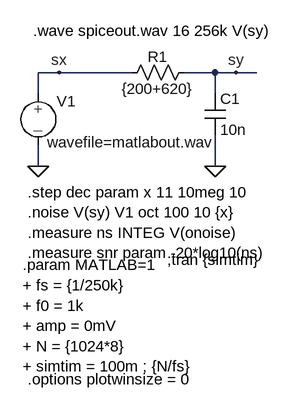
[diagram p0: schematic wavRead_matlab.asc]
wavRead_matlab.asc, the LTspice schematic file:
Version 4
SHEET 1 1008 720
WIRE 176 112 144 112
WIRE 288 112 176 112
WIRE 416 112 368 112
WIRE 448 112 416 112
WIRE 480 112 448 112
WIRE 144 144 144 112
WIRE 416 144 416 112
WIRE 144 256 144 224
WIRE 416 256 416 208
FLAG 144 256 0
FLAG 176 112 sx
FLAG 416 256 0
FLAG 448 112 sy
SYMBOL MDB_sym\\source-V 144 128 R0
WINDOW 3 14 91 Left 2
WINDOW 123 0 0 Left 2
WINDOW 39 0 0 Left 2
SYMATTR InstName V1
SYMATTR Value wavefile=matlabout.wav
SYMBOL res 272 128 R270
WINDOW 0 25 56 VTop 2
WINDOW 3 7 56 VBottom 2
SYMATTR InstName R1
SYMATTR Value {200+620}
SYMBOL cap 400 144 R0
SYMATTR InstName C1
SYMATTR Value 10n
TEXT 342 400 Left 2 !;tran {simtim}
TEXT 120 408 Left 2 !.param MATLAB=1\n+ fs = {1/250k}\n+ f0 = 1k\n+ amp = 0mV\n+ N = {1024*8}\n+ simtim = 100m ; {N/fs}
TEXT 136 48 Left 2 !.wave spiceout.wav 16 256k V(sy)
TEXT 128 584 Left 2 !.options plotwinsize = 0
TEXT 128 296 Left 2 !.step dec param x 11 10meg 10\n.noise V(sy) V1 oct 100 10 {x}\n.measure ns INTEG V(onoise)\n.measure snr param -20*log10(ns)

The netlist it stands for:
* wavRead_matlab.asc
V1 sx 0 wavefile=matlabout.wav
R1 sx sy {200+620}
C1 sy 0 10n
;tran {simtim}
.param MATLAB=1
+ fs = {1/250k}
+ f0 = 1k
+ amp = 0mV
+ N = {1024*8}
+ simtim = 100m ; {N/fs}
.wave spiceout.wav 16 256k V(sy)
.options plotwinsize = 0
.step dec param x 11 10meg 10
.noise V(sy) V1 oct 100 10 {x}
.measure ns INTEG V(onoise)
.measure snr param -20*log10(ns)
.backanno
.end